# Altium schematic sheet PSU.SchDoc
size A4; Organization: Medical Technologies CZ a.s.; Version1: N/A; Version2: N/A; Version3: N/A; Change1description: N/A; Change2description: N/A; Change3description: N/A; Change1DrawnBy: N/A; Change2DrawnBy: N/A; Change3DrawnBy: N/A; Change1CheckedBy: N/A; Change2CheckedBy: N/A; Change3CheckedBy: N/A; PreviusVersion_Chng1: N/A; PreviusVersion_Chng2: N/A; PreviusVersion_Chng3: N/A; Variant1description: Standard assembly; Variant2description: N/A; Variant3description: N/A; Variant4description: N/A; PrimaryCard1: XXXxxxXXX; PrimaryCard2: N/A; PrimaryCard3: N/A; PrimaryCard4: N/A; DocumentName: Docname
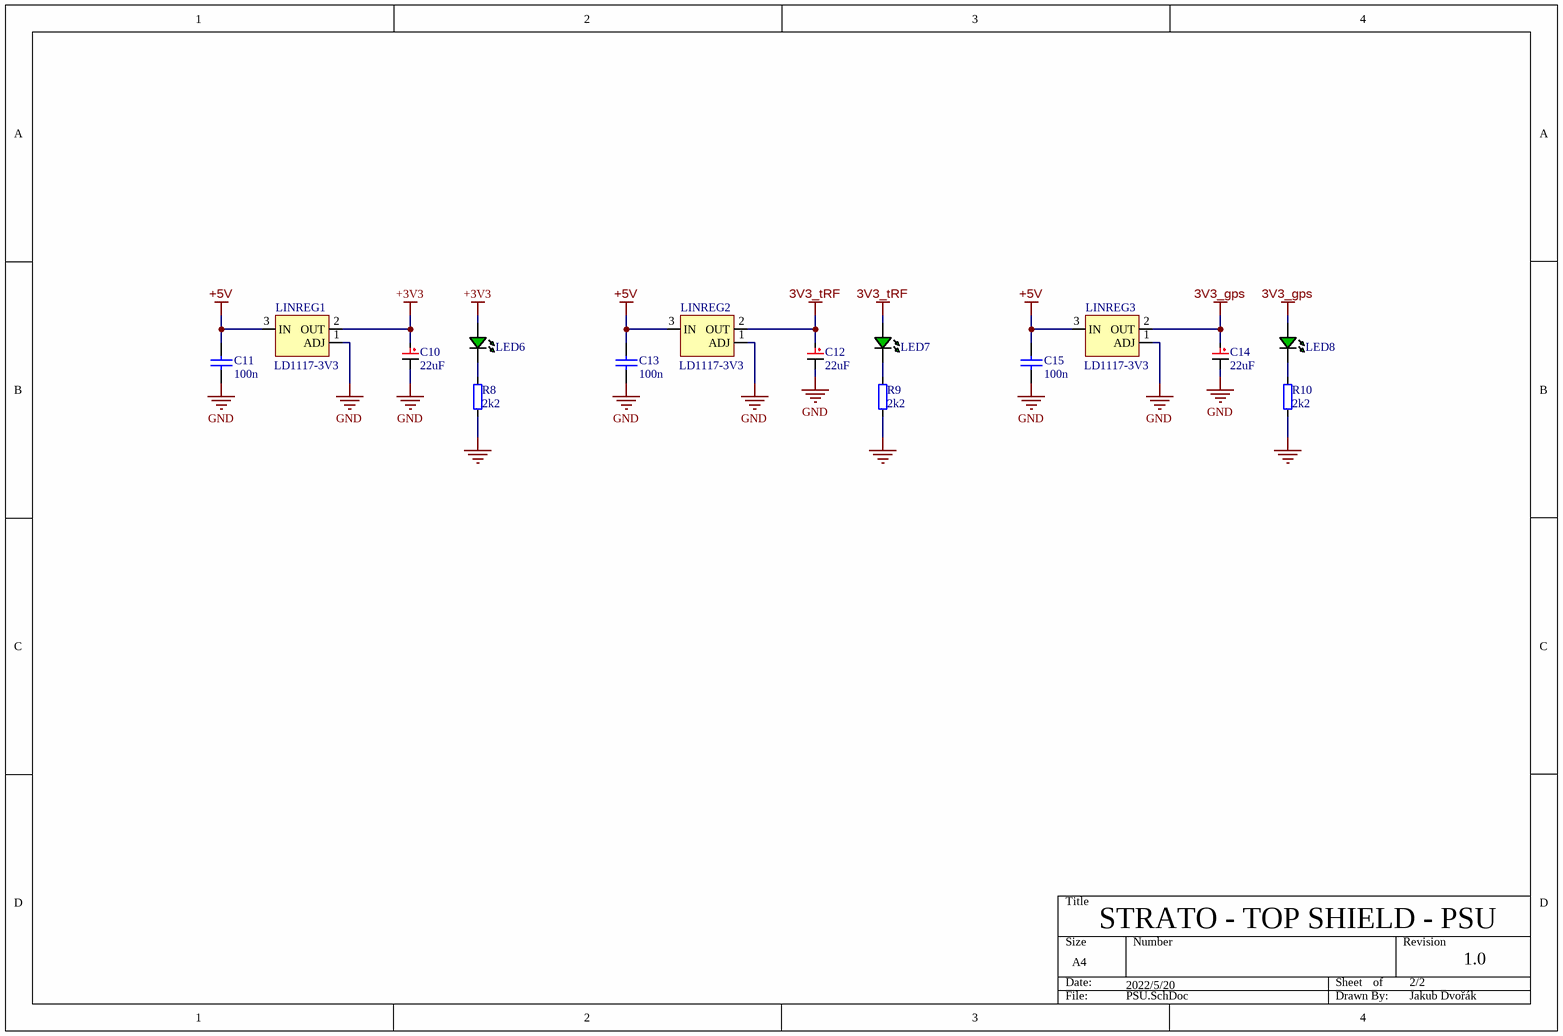
[diagram p0: PSU.SchDoc]

## Parts
C10  22uF  [CAP E-CASE TANTAL]
C11  100n  [WCAP-CSGP_0603_L1.6W0.8H0.8_Reflow]
C12  22uF  [CAP E-CASE TANTAL]
C13  100n  [WCAP-CSGP_0603_L1.6W0.8H0.8_Reflow]
C14  22uF  [CAP E-CASE TANTAL]
C15  100n  [WCAP-CSGP_0603_L1.6W0.8H0.8_Reflow]
LED6  green  [0805LEDG]  (value not drawn)
LED7  green  [0805LEDG]  (value not drawn)
LED8  green  [0805LEDG]  (value not drawn)
LINREG1  LD1117-3V3  [SOT223]
LINREG2  LD1117-3V3  [SOT223]
LINREG3  LD1117-3V3  [SOT223]
R8  value 2k2  [RES_0603]  (hidden comment: Thick film)
R9  value 2k2  [RES_0603]  (hidden comment: Thick film)
R10  value 2k2  [RES_0603]  (hidden comment: Thick film)

## Nets
3V3_gps: C14.+ LED8.A LINREG3.2(OUT)
3V3_tRF: C12.+ LED7.A LINREG2.2(OUT)
+3V3: C10.+ LED6.A LINREG1.2(OUT)
+5V: C11.2 C13.2 C15.2 LINREG1.3(IN) LINREG2.3(IN) LINREG3.3(IN)
GND: C10.- C11.1 C12.- C13.1 C14.- C15.1 LINREG1.1(ADJ) LINREG2.1(ADJ) LINREG3.1(ADJ) R8.1 R9.1 R10.1
NetLED6_K: LED6.K R8.2
NetLED7_K: LED7.K R9.2
NetLED8_K: LED8.K R10.2

## Notes on the sheet
- STRATO - TOP SHIELD - PSU
- 2022/5/20
- 2/2
- 1.0
- Jakub Dvořák
- Číslo výkresu /drawing number/:
- Nazev listu/sheet name/:
- DPS projekt/PCB project/:
- Kreslil /drawn by/ :
- Kontroloval /checked by/:
- Schvalil /approved by/:
- Podpis /signature/:
- Datum /date/:
- List /sheet/:
- /

## Library data of the parts
C10 C12 C14 = CAPT_22u_35V_E: CAPT 22u 35V case-E tatal; Manufacturer: VISHAY SPRAGUE; Manufacturer Part Number: TR3E226K035C0260; Supplier 1: Farnell; RoHS: YES; Stock 1: 21; Pricing 1: 5=17,858, 50=16,884, 100=16,234, 250=15,585, 400=14,936 (EUR); ComponentLink1URL: http://www.farnell.com/datasheets/438325.pdf; ComponentLink1Description: http://www.farnell.com/datasheets/438325.pdf; Supplier Part Number 1: 1754134
C11 C13 C15 = 885012206071R: WCAP-CSGP Multilayer Ceramic Chip Capacitor, General Purpose, size 0603, X7R, 100nF, 25V; Manufacturer: Wurth Elektronik; Capacitance Tolerance: +/-10%; Dissipation Factor: 3.5%; Isolation Resistance: 5GOhm; Technical Reference: X7R0603104K025DFCT20000; Capacitance: 100nF; Ceramic Type: X7R; ComponentLink1Description: Manufacturer Link; ComponentLink1URL: http://www.we-online.de; ComponentLink2Description: Datasheet; ComponentLink2URL: https://www.we-online.com/catalog/datasheet/885012206071R.pdf; Height: 0.8mm; Length: 1.6mm; Manufacturer Part Number: 885012206071R; Mounting Technology: SMT; Operating Temperature max.: 125C; Operating Temperature min.: -55C; Packaging: Tape and Reel; Rated Voltage: 25V; Size: 0603; Width: 0.8mm
LED6-LED8 = LEDG_0805
LINREG1-LINREG3 = LINREG_ADJ_LM1117DT: 15V 1A Adjustable low drop voltage regulator
R8-R10 = RES_2k2_5%_0603: 2200.00; Tolerance [%]: ±5; Power Rating [W]: 0.1; Case [EIA]: 0603; Case [Metric]: 1608; Value [Ω]: 2200.00